# Altium project Laser-Cueing.PrjPcb
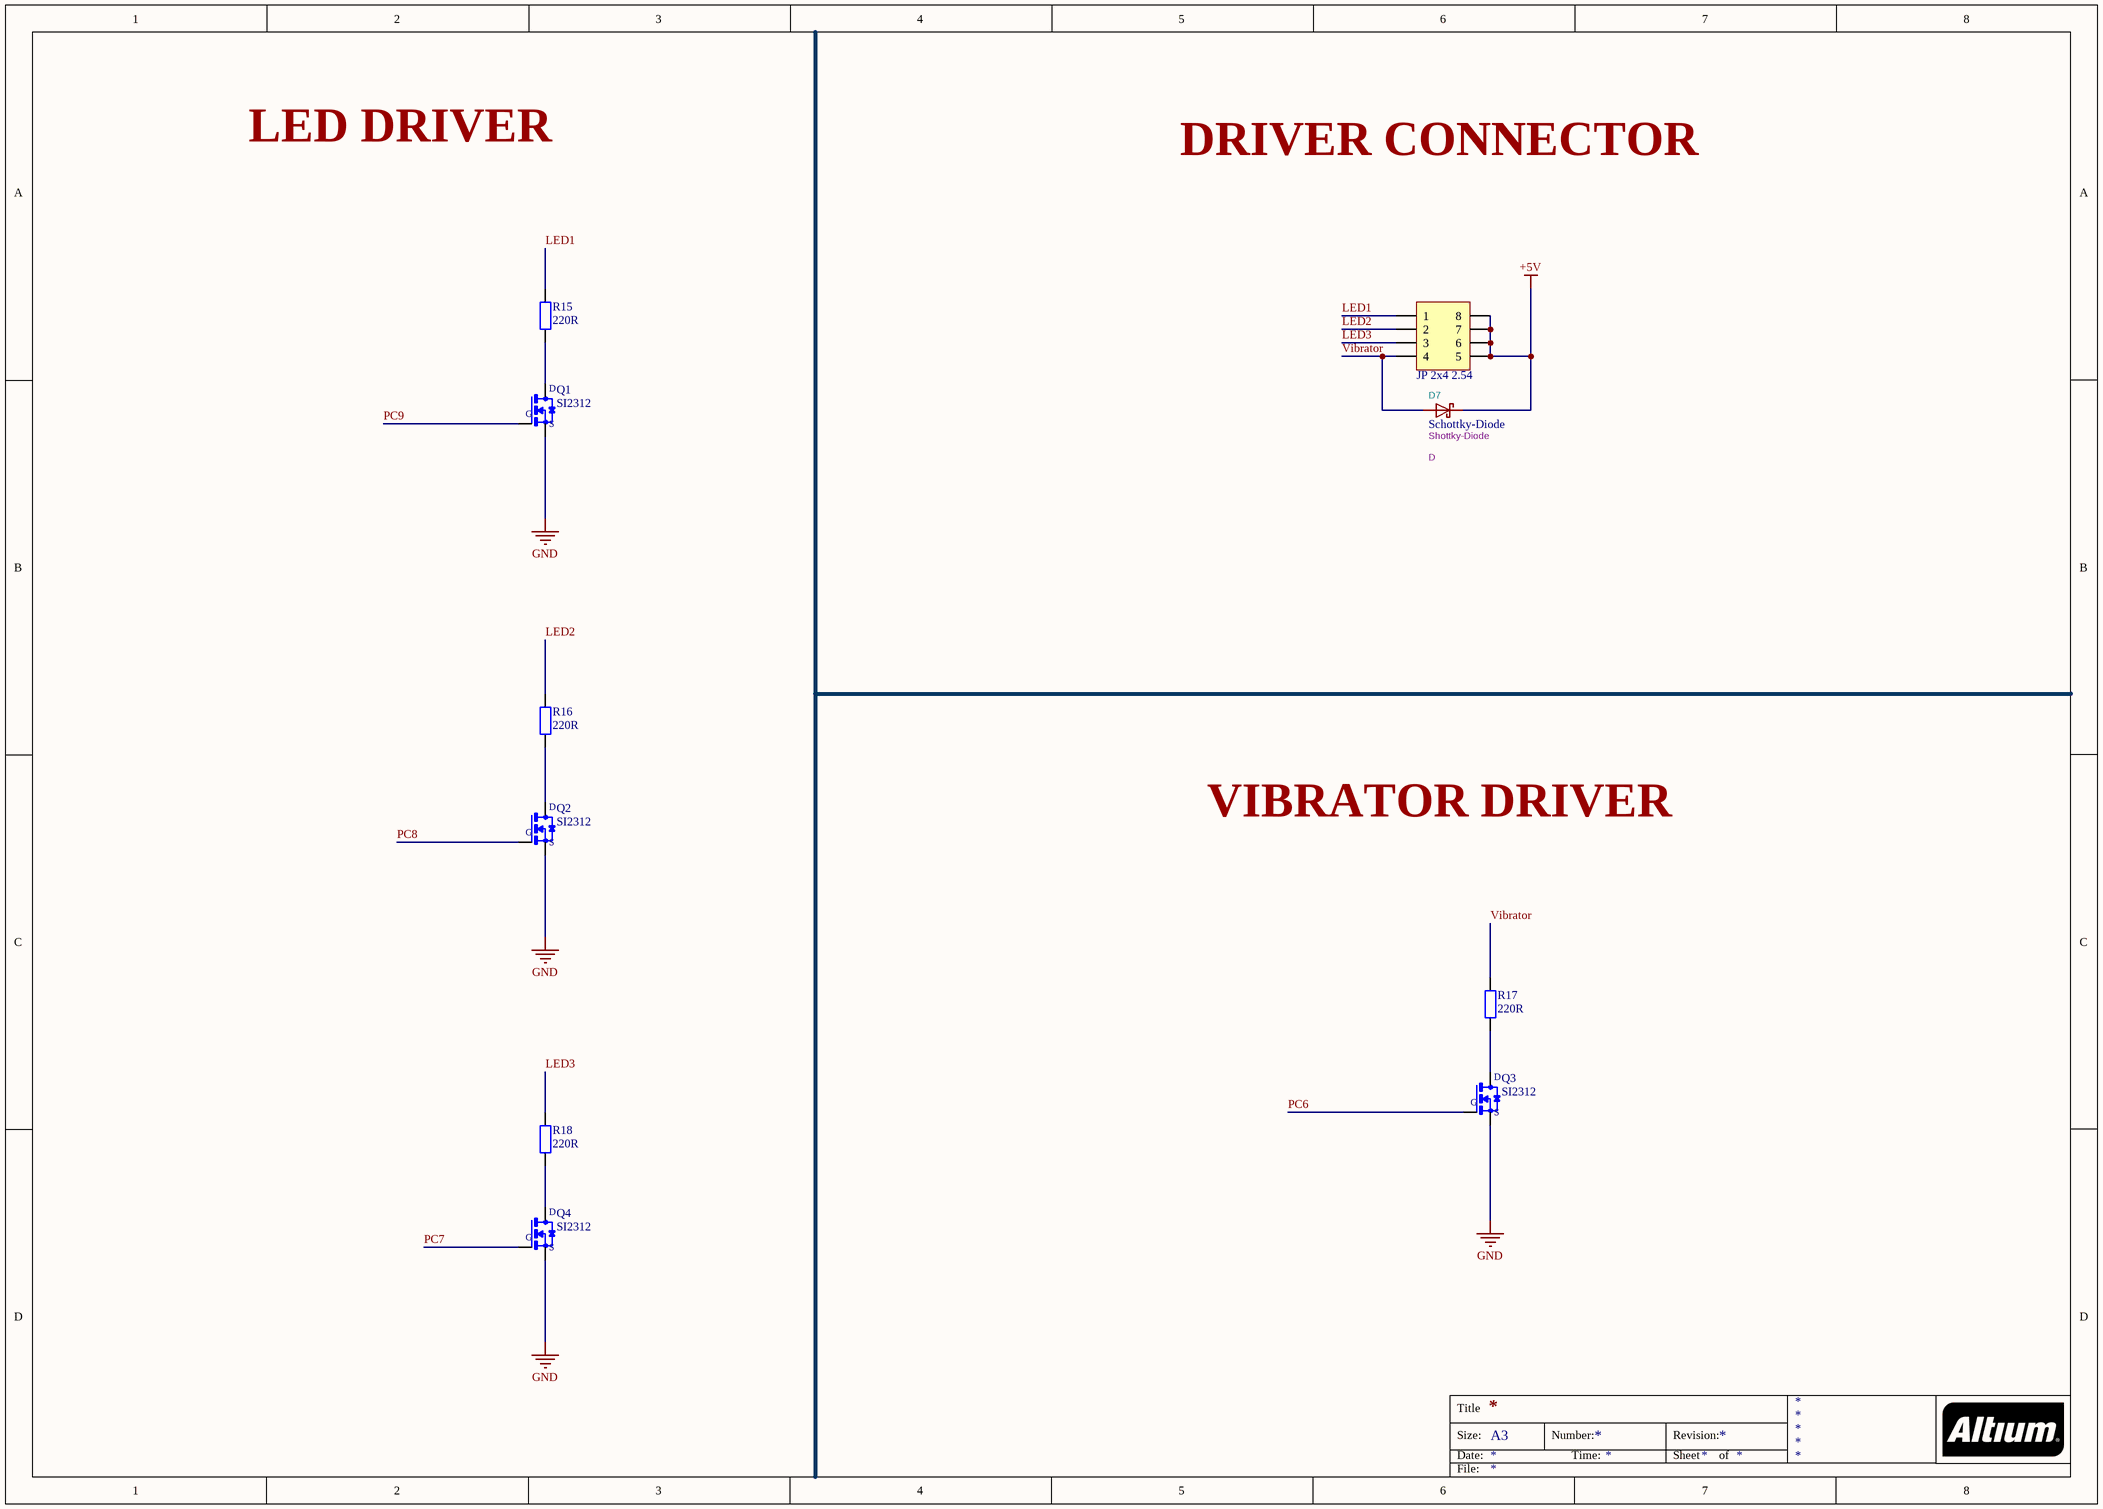
[diagram p0: Driver.SchDoc]
5 sheets, 91 parts. Net scope: global (net labels, ports and power ports of the same name join across sheets).
Board file: 06042024_LaserCueing.PcbDoc
Sheets:
  Driver.SchDoc
  STM32_MCU.SchDoc
  ADC.SchDoc
  Peripherial.SchDoc
  PWR_SRC.SchDoc

## Sheet Driver.SchDoc
size A3

### Parts
D7  Schottky-Diode  value Shottky-Diode  Reference: D  [SOD-80_MiniMELF_Glass]
Driver1  JP 2x4 2.54  [JP 2x4 DT]
Q1  SI2312  [SOT23]
Q2  SI2312  [SOT23]
Q3  SI2312  [SOT23]
Q4  SI2312  [SOT23]
R15  220R  [tro smd 0603]
R16  220R  [tro smd 0603]
R17  220R  [tro smd 0603]
R18  220R  [tro smd 0603]

### Nets
+5V: D7.K Driver1.5 Driver1.6 Driver1.7 Driver1.8
GND: Q1.2(S) Q2.2(S) Q3.2(S) Q4.2(S)
LED1: Driver1.1 R15.2
LED2: Driver1.2 R16.2
LED3: Driver1.3 R18.2
PC6: Q3.1(G)
PC7: Q4.1(G)
PC8: Q2.1(G)
PC9: Q1.1(G)
Vibrator: D7.A Driver1.4 R17.2
NetQ1_3: Q1.3(D) R15.1
NetQ2_3: Q2.3(D) R16.1
NetQ3_3: Q3.3(D) R17.1
NetQ4_3: Q4.3(D) R18.1

### Notes on the sheet
- LED DRIVER
- DRIVER CONNECTOR
- VIBRATOR DRIVER
- Title
- Size:
- Date:
- A3
- Number:
- Time:
- Revision:
- Sheet
- of
- File:

### Library data of the parts
D7 = Schottky-Diode: ki_description: Schottky Diode; Datasheet: https://diotec.com/de/produktliste/SBD.html; ki_keywords: Schottky
Driver1 = JP 2x4 2.54 Duc Thang: Cắm; Ten_Linh_Kien: Jump Đôi Đực 2.54MM 2x40P Thẳng 11MM; Don_Vi: Con; Ma_Hang: MH002686; Ghi_Chu: *; Kieu_Chan: *; Chung_Loai: Cắm
Q1-Q4 = SI2312: <b>N-Channel MOSFET</b>    <a href="https://pricing.snapeda.com/parts/SI2312/Micro%20Commercial%20Components/view-part?ref=eda">Check availability</a> <a href="https://pricing.snapeda.com/parts/SI2312/Micro%20Commercial%20Components/view-part?ref=eda">Check availability</a>; MF: {'manufacturer': u'Micro Commercial Components'}; MP: SI2312-TP; Package: None; Price: None; Value: *; Availability: Unavailable
R15-R18 = Tro 0603 5% 220R: Dán; Don_Vi: Con; So_Chan: 2; Ten_Linh_Kien: Trở 0603 5% 220R; Ma_Hang: MH006322; Chung_Loai: Dán; Kieu_Chan: *

## Sheet STM32_MCU.SchDoc
size A2
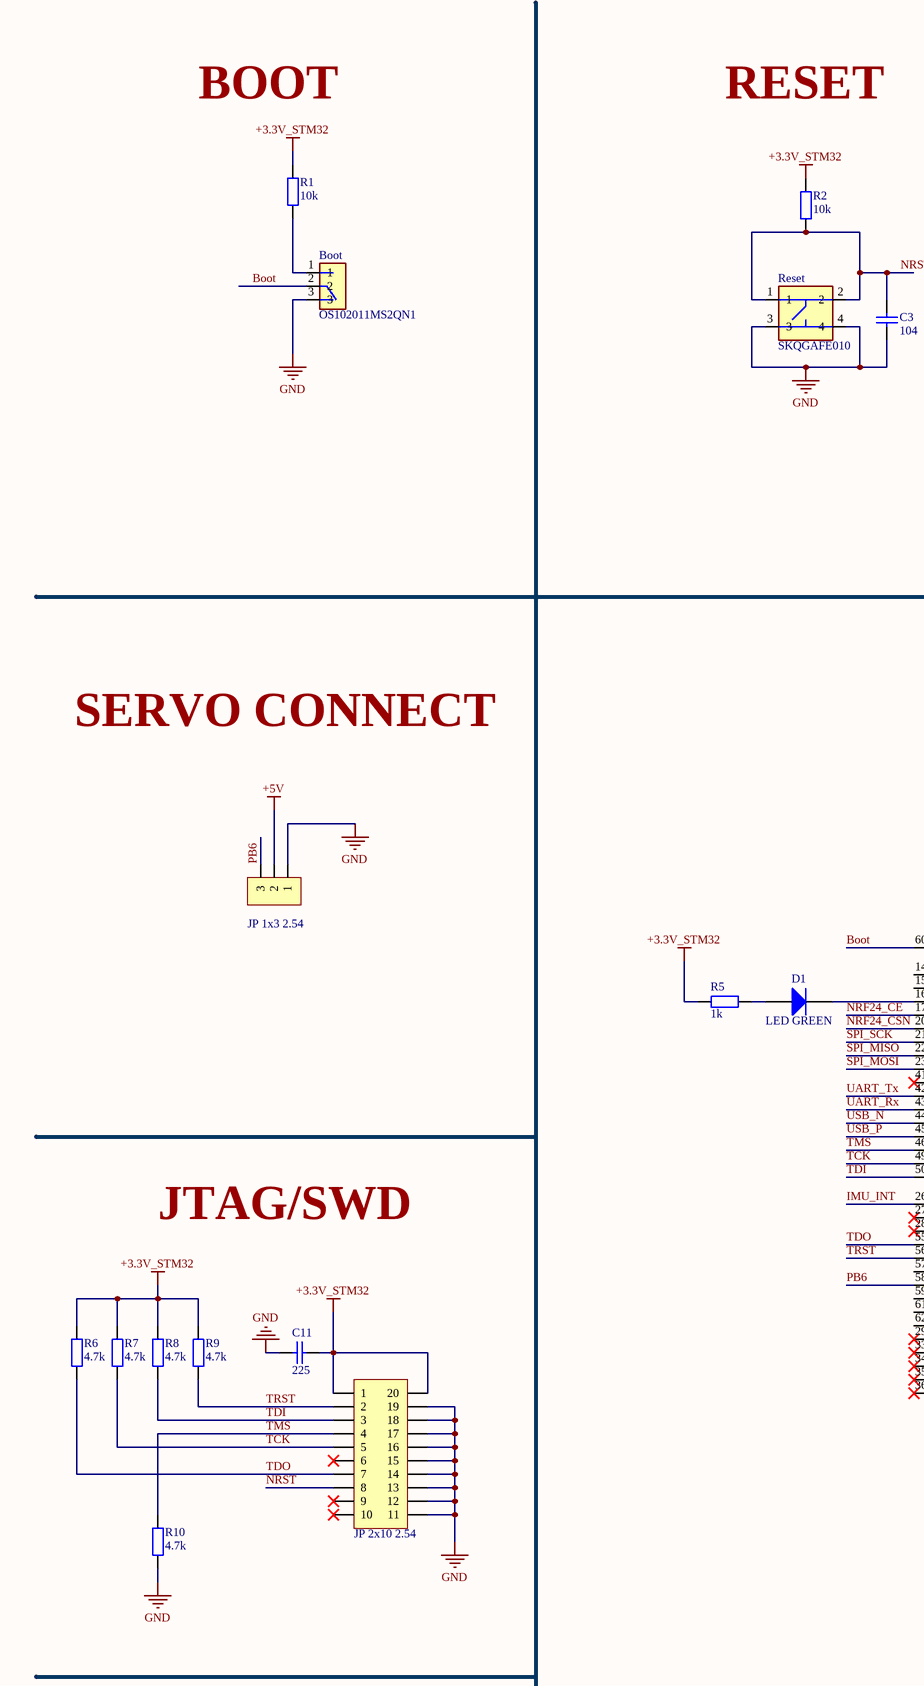
[diagram p1: STM32_MCU.SchDoc, left]
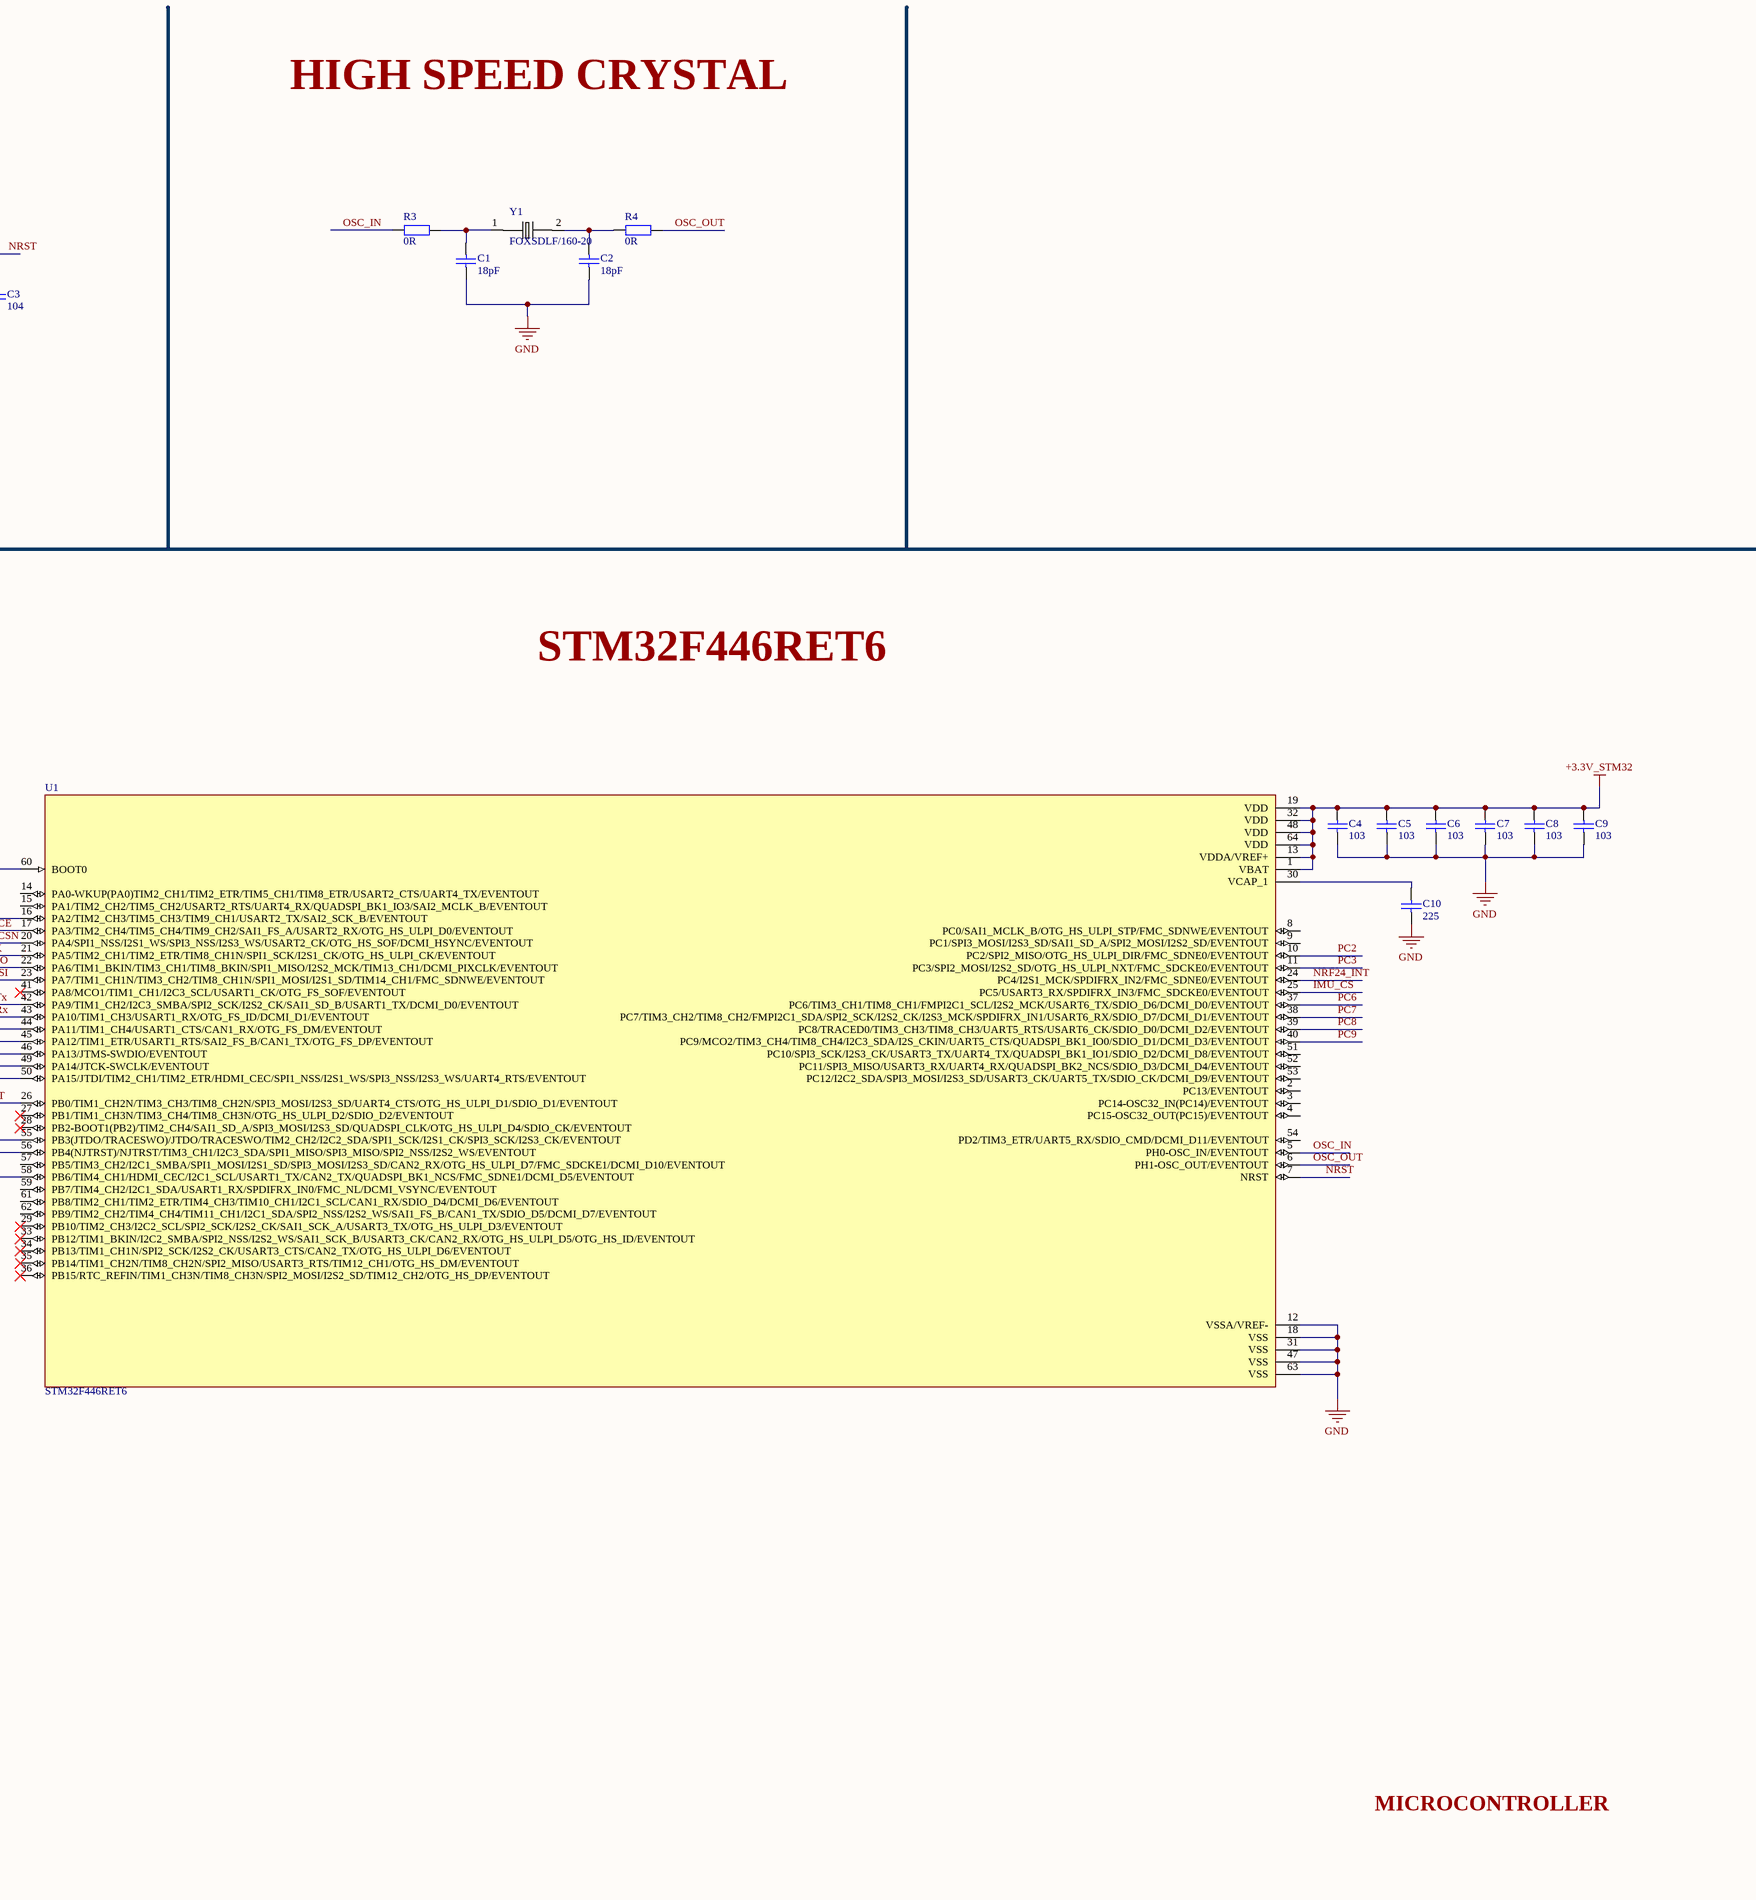
[diagram p2: STM32_MCU.SchDoc, right]

### Parts
Boot  OS102011MS2QN1  [SW_OS102011MS2QN1]
C1  18pF  [tu 0805]
C2  18pF  [tu 0805]
C3  104  [tu 1206]
C4  103  [tu 0603]
C5  103  [tu 0603]
C6  103  [tu 0603]
C7  103  [tu 0603]
C8  103  [tu 0603]
C9  103  [tu 0603]
C10  225  [tu 0805]
C11  225  [tu 0805]
D1  LED GREEN  [J1-0603]
R1  10k  [tro smd 0603]
R2  10k  [tro smd 0603]
R3  0R  [tro smd 0603]
R4  0R  [tro smd 0603]
R5  1k  [tro smd 0603]
R6  4.7k  [tro smd 0603]
R7  4.7k  [tro smd 0603]
R8  4.7k  [tro smd 0603]
R9  4.7k  [tro smd 0603]
R10  4.7k  [tro smd 0603]
Reset  SKQGAFE010  [SW_SKQGAFE010]
Servo  JP 1x3 2.54  [JP 1x3 DT]
SWD/JTAG1  JP 2x10 2.54  [JP 2x10 DT]
U1  STM32F446RET6  [QFP50P1200X1200X160-64N]
Y1  FOXSDLF/160-20  [SMD_Crystal]

### Nets
+3.3V_STM32: C4.1 C5.1 C6.1 C7.1 C8.1 C9.1 C11.1 R1.2 R2.2 R5.2 R6.2 R7.2 R8.2 R9.2 SWD/JTAG1.1 SWD/JTAG1.20 U1.1(VBAT) U1.13(VDDA/VREF+) U1.19(VDD) U1.32(VDD) U1.48(VDD) U1.64(VDD)
+5V: Servo.2
GND: Boot.3 C1.2 C2.2 C3.2 C4.2 C5.2 C6.2 C7.2 C8.2 C9.2 C10.2 C11.2 R10.1 Reset.3 Reset.4 Servo.1 SWD/JTAG1.11 SWD/JTAG1.12 SWD/JTAG1.13 SWD/JTAG1.14 SWD/JTAG1.15 SWD/JTAG1.16 SWD/JTAG1.17 SWD/JTAG1.18 SWD/JTAG1.19 U1.12(VSSA/VREF-) U1.18(VSS) U1.31(VSS) U1.47(VSS) U1.63(VSS)
Boot: Boot.2 U1.60(BOOT0)
IMU_CS: U1.25(PC5/USART3_RX/SPDIFRX_IN3/FMC_SDCKE0/EVENTOUT)
IMU_INT: U1.26(PB0/TIM1_CH2N/TIM3_CH3/TIM8_CH2N/SPI3_MOSI/I2S3_SD/UART4_CTS/OTG_HS_ULPI_D1/SDIO_D1/EVENTOUT)
NRF24_CE: U1.17(PA3/TIM2_CH4/TIM5_CH4/TIM9_CH2/SAI1_FS_A/USART2_RX/OTG_HS_ULPI_D0/EVENTOUT)
NRF24_CSN: U1.20(PA4/SPI1_NSS/I2S1_WS/SPI3_NSS/I2S3_WS/USART2_CK/OTG_HS_SOF/DCMI_HSYNC/EVENTOUT)
NRF24_INT: U1.24(PC4/I2S1_MCK/SPDIFRX_IN2/FMC_SDNE0/EVENTOUT)
NRST: C3.1 R2.1 Reset.1 Reset.2 SWD/JTAG1.8 U1.7(NRST)
OSC_IN: R3.1 U1.5(PH0-OSC_IN/EVENTOUT)
OSC_OUT: R4.2 U1.6(PH1-OSC_OUT/EVENTOUT)
PB6: Servo.3 U1.58(PB6/TIM4_CH1/HDMI_CEC/I2C1_SCL/USART1_TX/CAN2_TX/QUADSPI_BK1_NCS/FMC_SDNE1/DCMI_D5/EVENTOUT)
PC2: U1.10(PC2/SPI2_MISO/OTG_HS_ULPI_DIR/FMC_SDNE0/EVENTOUT)
PC3: U1.11(PC3/SPI2_MOSI/I2S2_SD/OTG_HS_ULPI_NXT/FMC_SDCKE0/EVENTOUT)
PC6: U1.37(PC6/TIM3_CH1/TIM8_CH1/FMPI2C1_SCL/I2S2_MCK/USART6_TX/SDIO_D6/DCMI_D0/EVENTOUT)
PC7: U1.38(PC7/TIM3_CH2/TIM8_CH2/FMPI2C1_SDA/SPI2_SCK/I2S2_CK/I2S3_MCK/SPDIFRX_IN1/USART6_RX/SDIO_D7/DCMI_D1/EVENTOUT)
PC8: U1.39(PC8/TRACED0/TIM3_CH3/TIM8_CH3/UART5_RTS/USART6_CK/SDIO_D0/DCMI_D2/EVENTOUT)
PC9: U1.40(PC9/MCO2/TIM3_CH4/TIM8_CH4/I2C3_SDA/I2S_CKIN/UART5_CTS/QUADSPI_BK1_IO0/SDIO_D1/DCMI_D3/EVENTOUT)
SPI_MISO: U1.22(PA6/TIM1_BKIN/TIM3_CH1/TIM8_BKIN/SPI1_MISO/I2S2_MCK/TIM13_CH1/DCMI_PIXCLK/EVENTOUT)
SPI_MOSI: U1.23(PA7/TIM1_CH1N/TIM3_CH2/TIM8_CH1N/SPI1_MOSI/I2S1_SD/TIM14_CH1/FMC_SDNWE/EVENTOUT)
SPI_SCK: U1.21(PA5/TIM2_CH1/TIM2_ETR/TIM8_CH1N/SPI1_SCK/I2S1_CK/OTG_HS_ULPI_CK/EVENTOUT)
TCK: R7.1 SWD/JTAG1.5 U1.49(PA14/JTCK-SWCLK/EVENTOUT)
TDI: R8.1 SWD/JTAG1.3 U1.50(PA15/JTDI/TIM2_CH1/TIM2_ETR/HDMI_CEC/SPI1_NSS/I2S1_WS/SPI3_NSS/I2S3_WS/UART4_RTS/EVENTOUT)
TDO: R6.1 SWD/JTAG1.7 U1.55(PB3(JTDO/TRACESWO)/JTDO/TRACESWO/TIM2_CH2/I2C2_SDA/SPI1_SCK/I2S1_CK/SPI3_SCK/I2S3_CK/EVENTOUT)
TMS: R10.2 SWD/JTAG1.4 U1.46(PA13/JTMS-SWDIO/EVENTOUT)
TRST: R9.1 SWD/JTAG1.2 U1.56(PB4(NJTRST)/NJTRST/TIM3_CH1/I2C3_SDA/SPI1_MISO/SPI3_MISO/SPI2_NSS/I2S2_WS/EVENTOUT)
UART_Rx: U1.43(PA10/TIM1_CH3/USART1_RX/OTG_FS_ID/DCMI_D1/EVENTOUT)
UART_Tx: U1.42(PA9/TIM1_CH2/I2C3_SMBA/SPI2_SCK/I2S2_CK/SAI1_SD_B/USART1_TX/DCMI_D0/EVENTOUT)
USB_N: U1.44(PA11/TIM1_CH4/USART1_CTS/CAN1_RX/OTG_FS_DM/EVENTOUT)
USB_P: U1.45(PA12/TIM1_ETR/USART1_RTS/SAI2_FS_B/CAN1_TX/OTG_FS_DP/EVENTOUT)
NetBoot_1: Boot.1 R1.1
NetC1_1: C1.1 R3.2 Y1.1
NetC2_1: C2.1 R4.1 Y1.2
NetC10_1: C10.1 U1.30(VCAP_1)
NetD1_1: D1.1(A) R5.1
NetD1_2: D1.2(K) U1.16(PA2/TIM2_CH3/TIM5_CH3/TIM9_CH1/USART2_TX/SAI2_SCK_B/EVENTOUT)

Not connected (* = marked no-connect by the designer): SWD/JTAG1 6* 9* 10*; U1 2(PC13/EVENTOUT) 3(PC14-OSC32_IN(PC14)/EVENTOUT) 4(PC15-OSC32_OUT(PC15)/EVENTOUT) 8(PC0/SAI1_MCLK_B/OTG_HS_ULPI_STP/FMC_SDNWE/EVENTOUT) 9(PC1/SPI3_MOSI/I2S3_SD/SAI1_SD_A/SPI2_MOSI/I2S2_SD/EVENTOUT) 14(PA0-WKUP(PA0)TIM2_CH1/TIM2_ETR/TIM5_CH1/TIM8_ETR/USART2_CTS/UART4_TX/EVENTOUT) 15(PA1/TIM2_CH2/TIM5_CH2/USART2_RTS/UART4_RX/QUADSPI_BK1_IO3/SAI2_MCLK_B/EVENTOUT) 27(PB1/TIM1_CH3N/TIM3_CH4/TIM8_CH3N/OTG_HS_ULPI_D2/SDIO_D2/EVENTOUT)* 28(PB2-BOOT1(PB2)/TIM2_CH4/SAI1_SD_A/SPI3_MOSI/I2S3_SD/QUADSPI_CLK/OTG_HS_ULPI_D4/SDIO_CK/EVENTOUT)* 29(PB10/TIM2_CH3/I2C2_SCL/SPI2_SCK/I2S2_CK/SAI1_SCK_A/USART3_TX/OTG_HS_ULPI_D3/EVENTOUT)* 33(PB12/TIM1_BKIN/I2C2_SMBA/SPI2_NSS/I2S2_WS/SAI1_SCK_B/USART3_CK/CAN2_RX/OTG_HS_ULPI_D5/OTG_HS_ID/EVENTOUT)* 34(PB13/TIM1_CH1N/SPI2_SCK/I2S2_CK/USART3_CTS/CAN2_TX/OTG_HS_ULPI_D6/EVENTOUT)* 35(PB14/TIM1_CH2N/TIM8_CH2N/SPI2_MISO/USART3_RTS/TIM12_CH1/OTG_HS_DM/EVENTOUT)* 36(PB15/RTC_REFIN/TIM1_CH3N/TIM8_CH3N/SPI2_MOSI/I2S2_SD/TIM12_CH2/OTG_HS_DP/EVENTOUT)* 41(PA8/MCO1/TIM1_CH1/I2C3_SCL/USART1_CK/OTG_FS_SOF/EVENTOUT)* 51(PC10/SPI3_SCK/I2S3_CK/USART3_TX/UART4_TX/QUADSPI_BK1_IO1/SDIO_D2/DCMI_D8/EVENTOUT) 52(PC11/SPI3_MISO/USART3_RX/UART4_RX/QUADSPI_BK2_NCS/SDIO_D3/DCMI_D4/EVENTOUT) 53(PC12/I2C2_SDA/SPI3_MOSI/I2S3_SD/USART3_CK/UART5_TX/SDIO_CK/DCMI_D9/EVENTOUT) 54(PD2/TIM3_ETR/UART5_RX/SDIO_CMD/DCMI_D11/EVENTOUT) 57(PB5/TIM3_CH2/I2C1_SMBA/SPI1_MOSI/I2S1_SD/SPI3_MOSI/I2S3_SD/CAN2_RX/OTG_HS_ULPI_D7/FMC_SDCKE1/DCMI_D10/EVENTOUT) 59(PB7/TIM4_CH2/I2C1_SDA/USART1_RX/SPDIFRX_IN0/FMC_NL/DCMI_VSYNC/EVENTOUT) 61(PB8/TIM2_CH1/TIM2_ETR/TIM4_CH3/TIM10_CH1/I2C1_SCL/CAN1_RX/SDIO_D4/DCMI_D6/EVENTOUT) 62(PB9/TIM2_CH2/TIM4_CH4/TIM11_CH1/I2C1_SDA/SPI2_NSS/I2S2_WS/SAI1_FS_B/CAN1_TX/SDIO_D5/DCMI_D7/EVENTOUT)

### Notes on the sheet
- BOOT
- RESET
- HIGH SPEED CRYSTAL
- SERVO CONNECT
- STM32F446RET6
- JTAG/SWD
- MICROCONTROLLER
- Title
- Size:
- Date:
- File:
- A2
- Number:
- Time:
- Revision:
- Sheet
- of

### Library data of the parts
Boot = OS102011MS2QN1: Switch Slide ON ON SPDT Top Slide 0.1A 12VDC 10000Cycles PC Pins Thru-Hole Bulk; MF: {'manufacturer': u'C&K'}; Package: None; Price: None; Value: *; MP: OS102011MS2QN1; Availability: Unavailable
C1 C2 = Tu 0805 20pF 50V 10%: Dán; Don_Vi: Con; Ten_Linh_Kien: Tụ 0805 20P 10% 50V; So_Chan: 2; Ma_Hang: MH004558; Chung_Loai: Dán; Kieu_Chan: *
C3 = Tu 1206 104 50V 20%: Dán; Don_Vi: Con; So_Chan: 2; Ten_Linh_Kien: Tụ 1206 104-0.1uF 20% 50V; Ma_Hang: MH004544; Chung_Loai: Dán; Kieu_Chan: *
C4-C9 = Tu 0603 103 50V 10%: Dán; Don_Vi: Con; So_Chan: 2; Ten_Linh_Kien: Tụ 0603 103-10nF 10% 50V; Ma_Hang: MH004567; Chung_Loai: Dán; Kieu_Chan: *
C10 C11 = Tu 0805 225 25V 10%: Dán; Don_Vi: Con; So_Chan: 2; Ten_Linh_Kien: Tụ 0805 225-2.2uF 25V 10%; Ma_Hang: MH007483; Chung_Loai: Dán; Kieu_Chan: *
D1 = Diode: Default Diode; Published: 8-Jun-2000; LatestRevisionDate: 17-Jul-2002; LatestRevisionNote: Re-released for DXP Platform.; PackageDocument: Sep-1996; PackageReference: SMC; Publisher: Altium Limited; Code_JEDEC: DO-214-AB
R1 R2 = Tro 0603 1% 10k: Dán; Don_Vi: Con; So_Chan: 2; Ten_Linh_Kien: Trở 0603 1% 10k; Ma_Hang: MH006333; Chung_Loai: Dán; Kieu_Chan: *
R3 R4 = Tro 0603 1% 0R: Dán; Don_Vi: Con; So_Chan: 2; Ten_Linh_Kien: Trở 0603 1% 0R; Ma_Hang: MH005792; Chung_Loai: Dán; Kieu_Chan: *
R5 = Tro 0603 1% 1k: Dán; So_Chan: 2; Don_Vi: Con; Ten_Linh_Kien: Trở 0603 1% 1k; Ma_Hang: MH006334; Chung_Loai: Dán; Kieu_Chan: *
R6-R10 = Tro 0603 5% 4.7k: Dán; Don_Vi: Con; So_Chan: 2; Ten_Linh_Kien: Trở 0603 5% 4.7k; Ma_Hang: MH006327; Chung_Loai: Dán; Kieu_Chan: *
Reset = SKQGAFE010: Switch Tactile N.O. SPST Button Gull Wing 0.05A 12VDC 0.98N SMD T/R; MF: {'manufacturer': u'ALPS'}; Package: None; Price: None; Value: *; MP: SKQGAFE010; Availability: Unavailable
Servo = JP 1x3 2.54 Duc Thang: Cắm; Ten_Linh_Kien: Jump Đơn Đực 2.54MM 1x40P Thẳng 11MM; Don_Vi: Con; Ma_Hang: MH000903; Ghi_Chu: *; Kieu_Chan: *; Chung_Loai: Cắm
SWD/JTAG1 = JP 2x10 2.54 Duc Thang: Cắm; Ten_Linh_Kien: Jump Đôi Đực 2.54MM 2x40P Thẳng 11MM; Don_Vi: Con; Ma_Hang: MH002686; Ghi_Chu: *; Kieu_Chan: *; Chung_Loai: Cắm
U1 = STM32F446RET6: MCU 32-Bit STM32 ARM Cortex M4 RISC 512KB Flash 2.5V/3.3V 64-Pin LQFP Tray; MF: {'manufacturer': u'STMicroelectronics'}; Package: None; Price: None; Value: *; MP: STM32F446RET6; Availability: Unavailable
Y1 = Crystal 16MHz 20pF 2-Pin: Crystal 16MHz 20pF 2-Pin HC-49/SD; MF: Fox; Package: HC49/US Fox; Digi-Key_Part_Number: 631-1017-2-ND; Digi-Key_Purchase_URL: https://www.digikey.tw/product-detail/en/fox-electronics/FC4SDCBMF16.0-T1/631-1017-2-ND/1024609?utm_source=snapeda&utm_medium=aggregator&utm_campaign=symbol; SnapEDA_Link: https://www.snapeda.com/parts/FOXSDLF/160-20/Fox%20Electronics/view-part/?ref=snap; MP: FOXSDLF/160-20; Value: *

## Sheet ADC.SchDoc
size A4
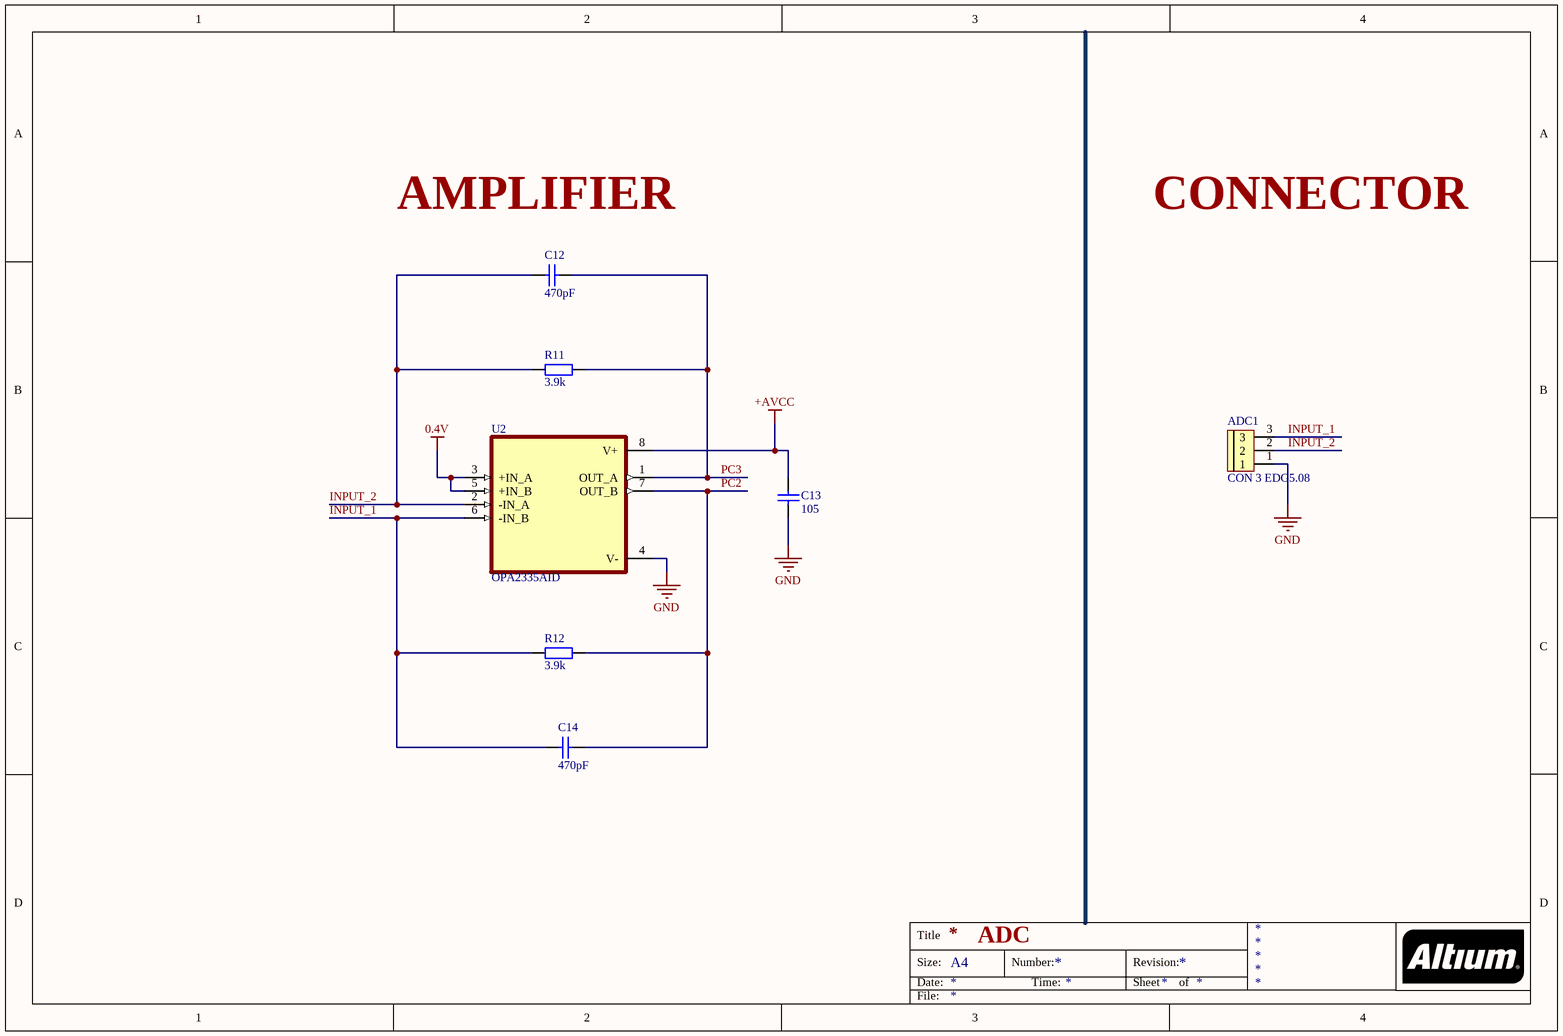
[diagram p3: ADC.SchDoc]

### Parts
ADC1  CON 3 EDG5.08  [CON 3 3EDG5.08]
C12  470pF  [tu 0603]
C13  105  [tu 1206]
C14  470pF  [tu 0603]
R11  3.9k  [tro smd 0603]
R12  3.9k  [tro smd 0603]
U2  OPA2335AID  [SOIC127P599X175-8N]

### Nets
0.4V: U2.3(+IN_A) U2.5(+IN_B)
+AVCC: C13.1 U2.8(V+)
GND: ADC1.1 C13.2 U2.4(V-)
INPUT_1: ADC1.3 C14.2 R12.1 U2.6(-IN_B)
INPUT_2: ADC1.2 C12.2 R11.1 U2.2(-IN_A)
PC2: C14.1 R12.2 U2.7(OUT_B)
PC3: C12.1 R11.2 U2.1(OUT_A)

### Notes on the sheet
- AMPLIFIER
- CONNECTOR
- ADC
- Title
- Size:
- Date:
- A4
- Number:
- Time:
- Revision:
- Sheet
- of
- File:

### Library data of the parts
ADC1 = CON 3 EDG5.08: Cắm; Ten_Linh_Kien: CON 3 2EDG5.08-3P 5.08MM ( Xanh Cong); Ma_Hang: MH000760; Ghi_Chu: *; Kieu_Chan: *; Don_Vi: Con; Chung_Loai: Cắm
C12 C14 = Tu 0603 470pF 50V 10%: Dán; Don_Vi: Con; So_Chan: 2; Ten_Linh_Kien: Tụ 0603 470P 50V 10%; Ma_Hang: MH004571; Chung_Loai: Dán; Kieu_Chan: *
C13 = Tu 1206 105 50V 20%: Dán; Don_Vi: Con; So_Chan: 2; Ten_Linh_Kien: Tụ 1206 105-1uF 20% 50V; Ma_Hang: MH004545; Chung_Loai: Dán; Kieu_Chan: *
R11 R12 = Tro 0603 1% 3.9k: Dán; So_Chan: 2; Ten_Linh_Kien: Trở 0603 1% 3.9k; Ma_Hang: MH005793; Don_Vi: Con; Chung_Loai: Dán; Kieu_Chan: *
U2 = OPA2335AID: MF: {'manufacturer': u'Texas Instruments'}; Package: None; Price: None; Value: *; MP: OPA2335AID; Availability: Unavailable

## Sheet Peripherial.SchDoc
size A3
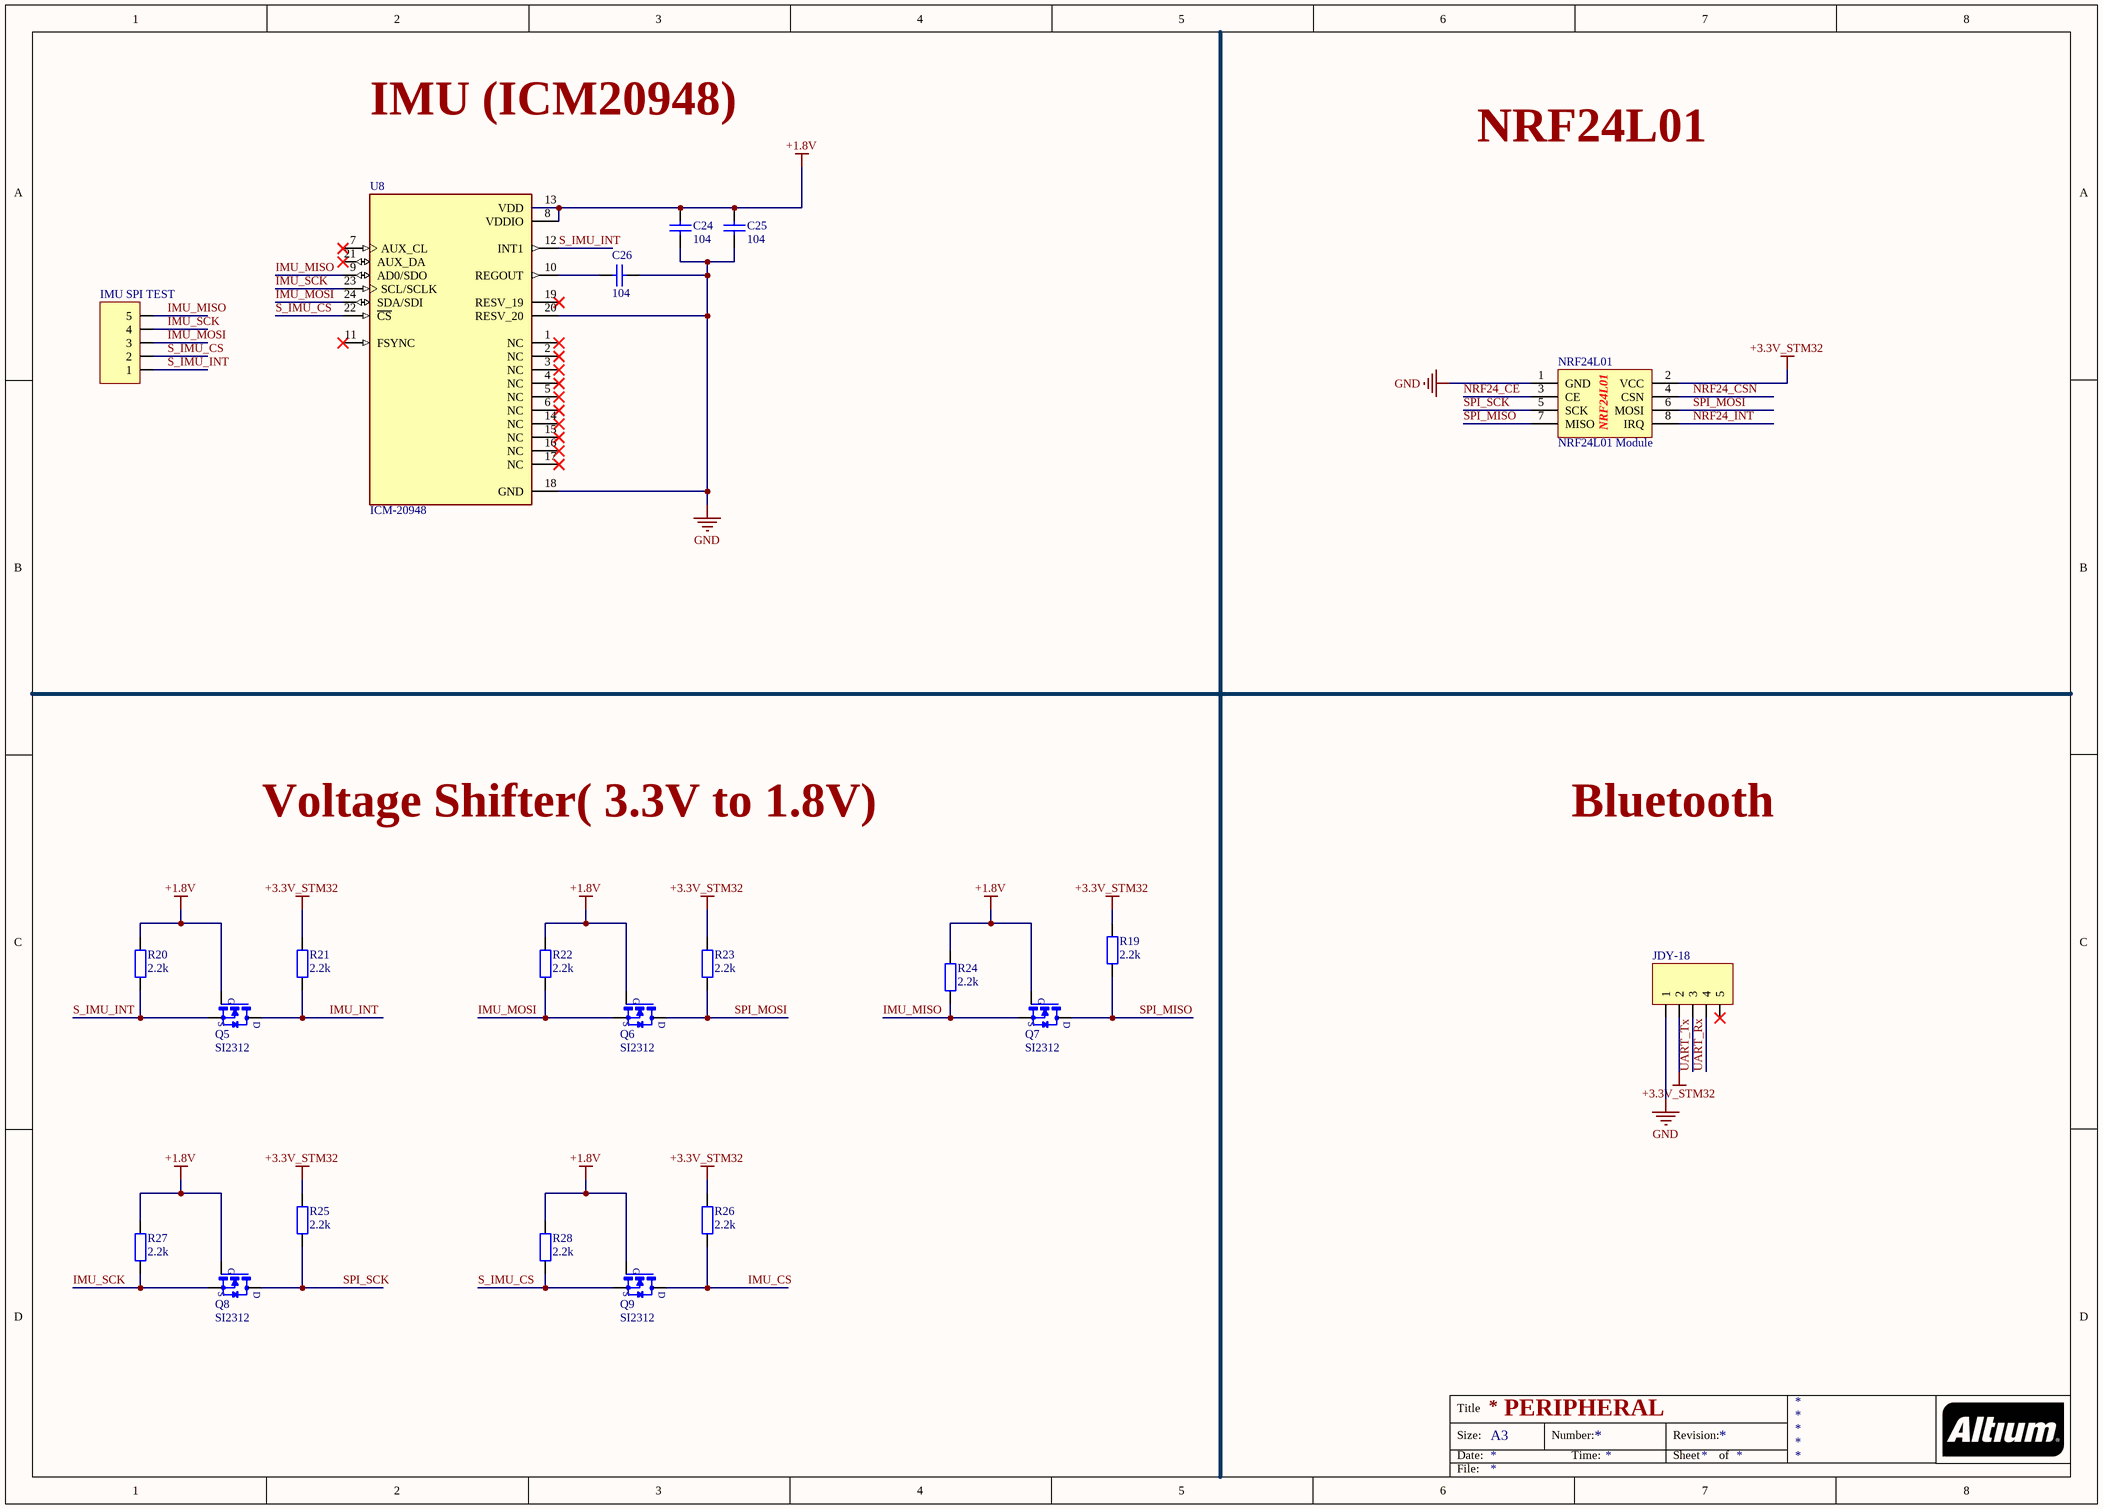
[diagram p4: Peripherial.SchDoc]

### Parts
C24  104  [tu 1206]
C25  104  [tu 1206]
C26  104  [tu 1206]
IMU_SPI_TEST  (no value)  [JP 1x5 DT]
JDY-18  JP 1x5 2.54  [JP 1x5 CC]  (value not drawn)
NRF24L01  NRF24L01 Module  [NRF24L01]
Q5  SI2312  [SOT23]
Q6  SI2312  [SOT23]
Q7  SI2312  [SOT23]
Q8  SI2312  [SOT23]
Q9  SI2312  [SOT23]
R19  2.2k  [tro smd 0603]
R20  2.2k  [tro smd 0603]
R21  2.2k  [tro smd 0603]
R22  2.2k  [tro smd 0603]
R23  2.2k  [tro smd 0603]
R24  2.2k  [tro smd 0603]
R25  2.2k  [tro smd 0603]
R26  2.2k  [tro smd 0603]
R27  2.2k  [tro smd 0603]
R28  2.2k  [tro smd 0603]
U8  ICM-20948  [QFN40P300X300X105-24N]

### Nets
+1.8V: C24.1 C25.1 Q5.1(G) Q6.1(G) Q7.1(G) Q8.1(G) Q9.1(G) R20.2 R22.2 R24.2 R27.2 R28.2 U8.8(VDDIO) U8.13(VDD)
+3.3V_STM32: JDY-18.2 NRF24L01.2(VCC) R19.2 R21.2 R23.2 R25.2 R26.2
GND: C24.2 C25.2 C26.2 JDY-18.1 NRF24L01.1(GND) U8.18(GND) U8.20(RESV_20)
IMU_CS: Q9.3(D) R26.1
IMU_INT: Q5.3(D) R21.1
IMU_MISO: IMU_SPI_TEST.5 Q7.2(S) R24.1 U8.9(AD0/SDO)
IMU_MOSI: IMU_SPI_TEST.3 Q6.2(S) R22.1 U8.24(SDA/SDI)
IMU_SCK: IMU_SPI_TEST.4 Q8.2(S) R27.1 U8.23(SCL/SCLK)
NRF24_CE: NRF24L01.3(CE)
NRF24_CSN: NRF24L01.4(CSN)
NRF24_INT: NRF24L01.8(IRQ)
S_IMU_CS: IMU_SPI_TEST.2 Q9.2(S) R28.1 U8.22(~{CS})
S_IMU_INT: IMU_SPI_TEST.1 Q5.2(S) R20.1 U8.12(INT1)
SPI_MISO: NRF24L01.7(MISO) Q7.3(D) R19.1
SPI_MOSI: NRF24L01.6(MOSI) Q6.3(D) R23.1
SPI_SCK: NRF24L01.5(SCK) Q8.3(D) R25.1
UART_Rx: JDY-18.4
UART_Tx: JDY-18.3
NetC26_1: C26.1 U8.10(REGOUT)

Not connected (* = marked no-connect by the designer): JDY-18 5*; U8 1(NC)* 2(NC)* 3(NC)* 4(NC)* 5(NC)* 6(NC)* 7(AUX_CL)* 11(FSYNC)* 14(NC)* 15(NC)* 16(NC)* 17(NC)* 19(RESV_19)* 21(AUX_DA)*

### Notes on the sheet
- IMU (ICM20948)
- NRF24L01
- Voltage Shifter( 3.3V to 1.8V)
- Bluetooth
- PERIPHERAL
- Title
- Size:
- Date:
- A3
- Number:
- Time:
- Revision:
- Sheet
- of
- File:

### Library data of the parts
C24-C26 = Tu 1206 104 50V 20%: as C3 on sheet STM32_MCU; Chung_Loai: Dán; Kieu_Chan: *
IMU_SPI_TEST = JP 1x5 2.54 Duc Thang: Cắm; Ten_Linh_Kien: Jump Đơn Đực 2.54MM 1x40P Thẳng 11MM; Don_Vi: Con; Ma_Hang: MH000903; Ghi_Chu: *; Kieu_Chan: *; Chung_Loai: Cắm
JDY-18 = JP 1x5 2.54 Cai Cong: Cắm; Ten_Linh_Kien: Jump Đơn Cái 2.54MM 1x40P Cong; Don_Vi: Con; Ma_Hang: MH001265; Ghi_Chu: *; Kieu_Chan: *; Chung_Loai: Cắm
Q5-Q9 = SI2312: as Q1 on sheet Driver; Package: None; Price: None; Value: *; Availability: Unavailable
R19-R28 = Tro 0603 5% 2.2k: Dán; Don_Vi: Con; So_Chan: 2; Ten_Linh_Kien: Trở 0603 5% 2.2k; Ma_Hang: MH006321; Chung_Loai: Dán; Kieu_Chan: *
U8 = ICM-20948: Accelerometer, Gyroscope, Magnetometer, 9 Axis Sensor IÂ²C, SPI Output; MF: {'manufacturer': u'TDK InvenSense'}; Package: None; Price: None; Value: *; MP: ICM-20948; Availability: Unavailable

## Sheet PWR_SRC.SchDoc
size A3
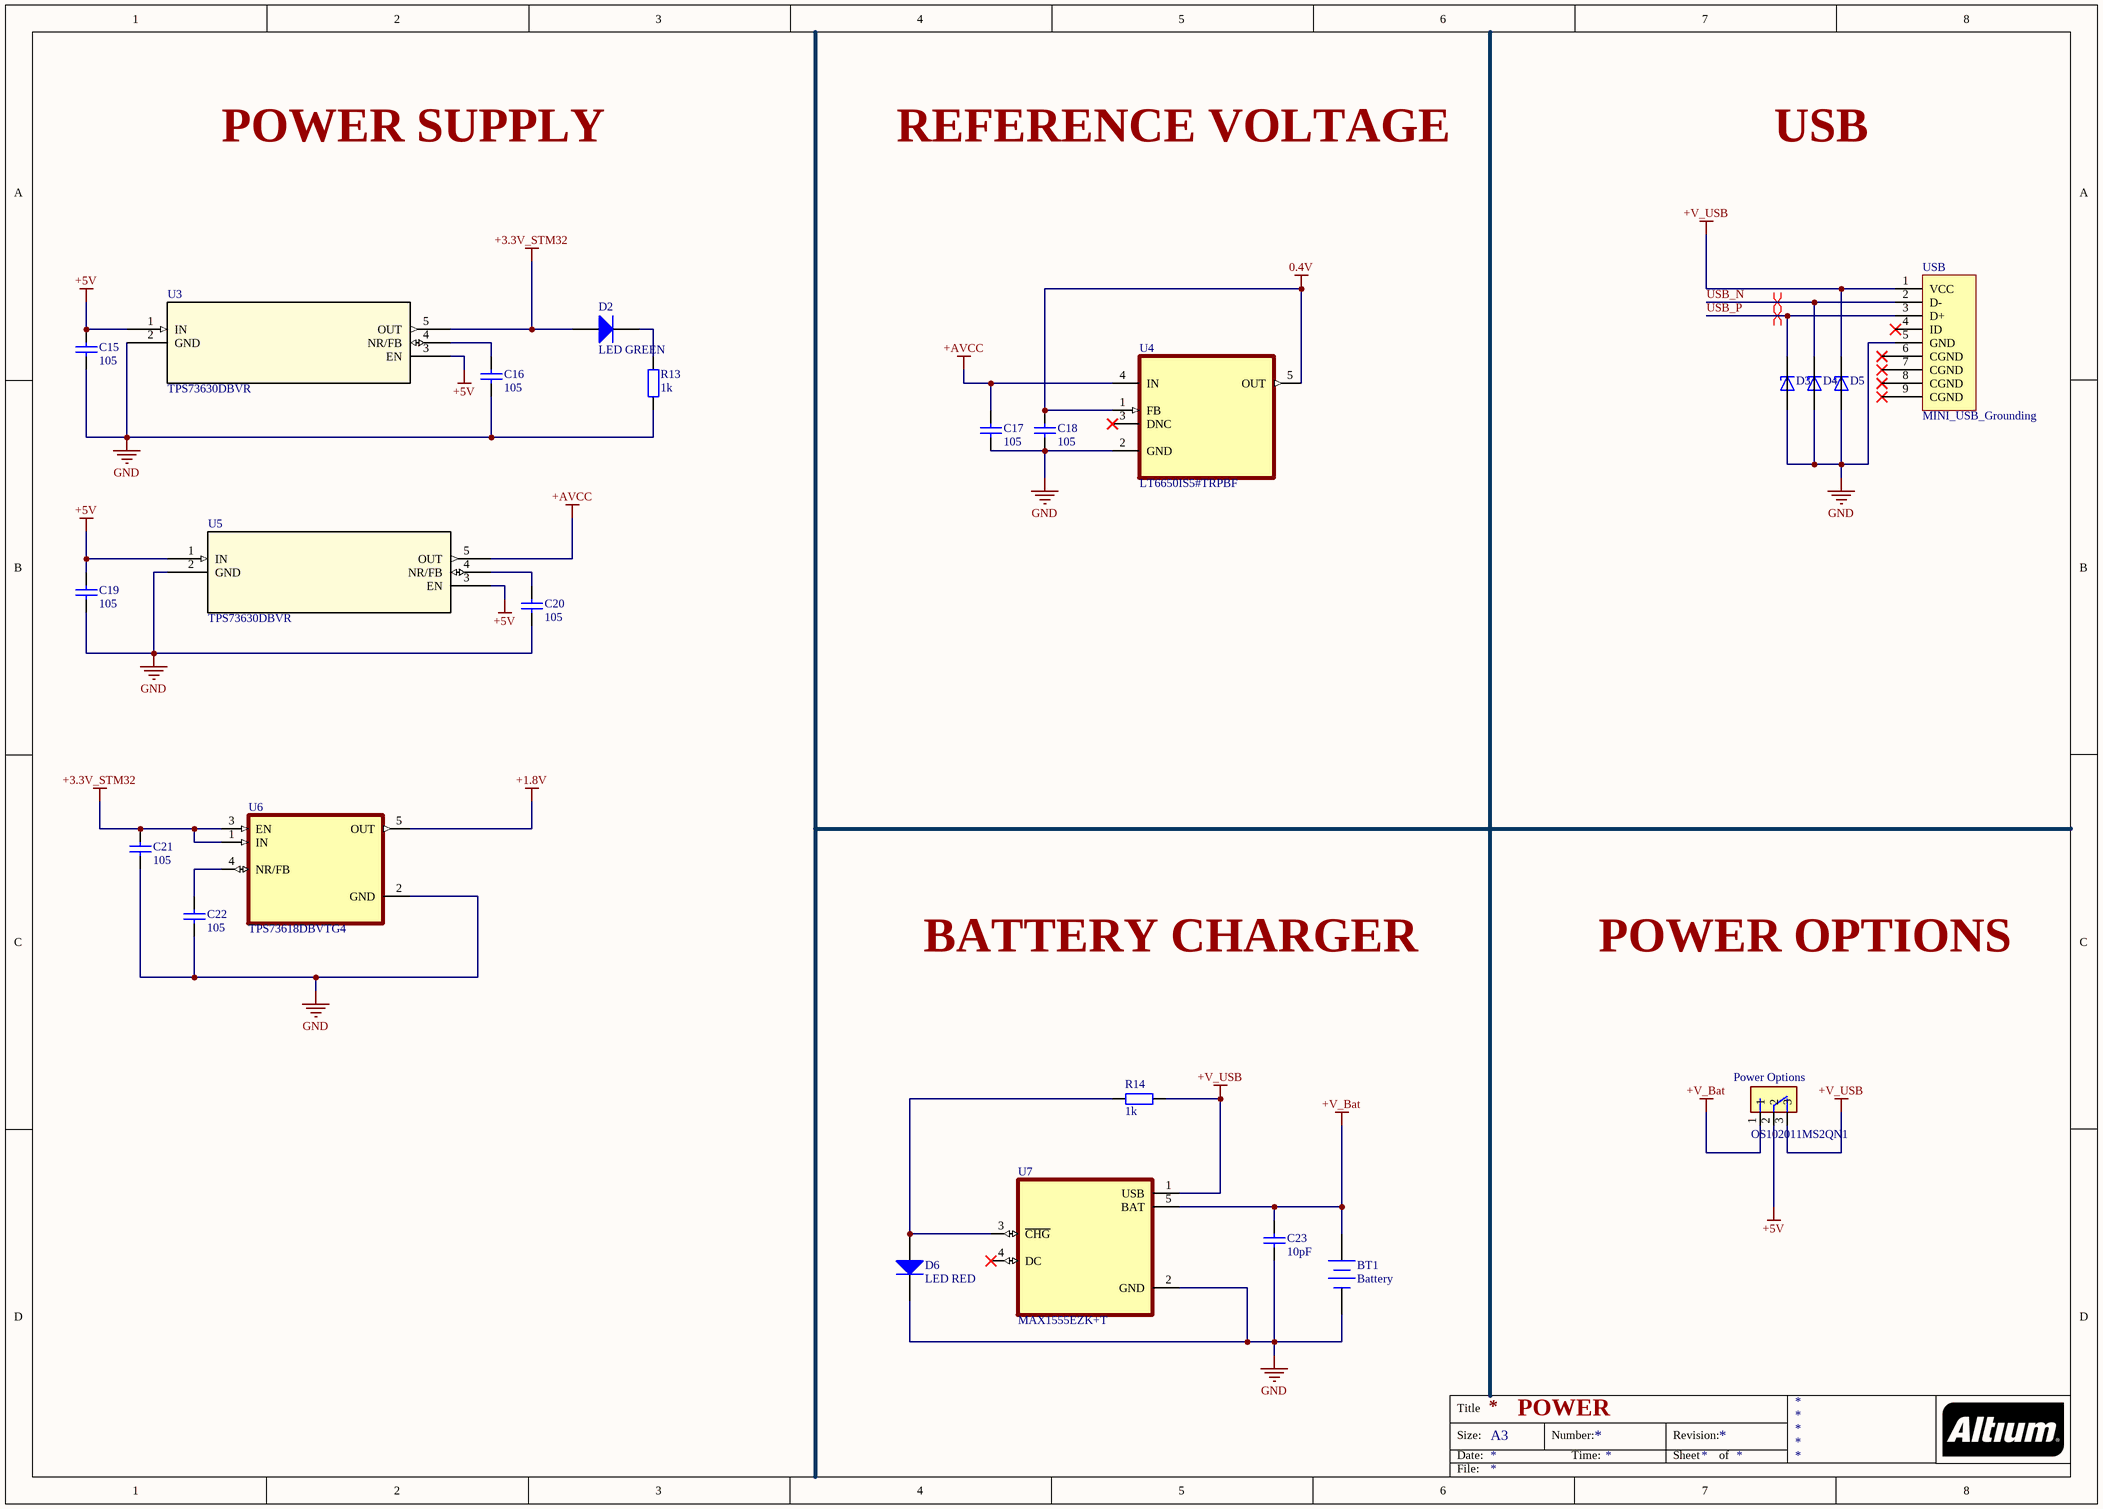
[diagram p5: PWR_SRC.SchDoc]

### Parts
BT1  Battery  [BAT-2]
C15  105  [tu 0603]
C16  105  [tu 0603]
C17  105  [tu 0603]
C18  105  [tu 0603]
C19  105  [tu 0603]
C20  105  [tu 0603]
C21  105  [tu 0603]
C22  105  [tu 0603]
C23  10pF  [tu 0805]
D2  LED GREEN  [J1-0603]
D3  AVRL161A1R1NTA  [TVS_AVRL161A1R1NTA]  (value not drawn)
D4  AVRL161A1R1NTA  [TVS_AVRL161A1R1NTA]  (value not drawn)
D5  AVRL161A1R1NTA  [TVS_AVRL161A1R1NTA]  (value not drawn)
D6  LED RED  [J1-0603]
Power_Options  OS102011MS2QN1  [SW_OS102011MS2QN1]
R13  1k  [tro smd 0603]
R14  1k  [tro smd 0603]
U3  TPS73630DBVR  [DBV5-M]
U4  LT6650IS5#TRPBF  [SOT95P280X100-5N]
U5  TPS73630DBVR  [DBV5-M]
U6  TPS73618DBVTG4  [SOT95P280X145-5N]
U7  MAX1555EZK+T  [SOT95P275X110-5N]
USB  MINI_USB_Grounding  [micro_USB shilding]

### Nets
0.4V: C18.1 U4.1(FB) U4.5(OUT)
+1.8V: U6.5(OUT)
+3.3V_STM32: C21.1 D2.1(A) U3.5(OUT) U6.1(IN) U6.3(EN)
+5V: C15.1 C19.1 Power_Options.2 U3.1(IN) U3.3(EN) U5.1(IN) U5.3(EN)
+AVCC: C17.1 U4.4(IN) U5.5(OUT)
+V_Bat: BT1.1(+) C23.1 Power_Options.1 U7.5(BAT)
+V_USB: D5.1(C) Power_Options.3 R14.2 U7.1(USB) USB.1(VCC)
GND: BT1.2(-) C15.2 C16.2 C17.2 C18.2 C19.2 C20.2 C21.2 C22.2 C23.2 D3.2(A) D4.2(A) D5.2(A) D6.2(K) R13.2 U3.2(GND) U4.2(GND) U5.2(GND) U6.2(GND) U7.2(GND) USB.5(GND)
USB_N: D4.1(C) USB.2(D-)
USB_P: D3.1(C) USB.3(D+)
NetC16_1: C16.1 U3.4(NR/FB)
NetC20_1: C20.1 U5.4(NR/FB)
NetC22_1: C22.1 U6.4(NR/FB)
NetD2_2: D2.2(K) R13.1
NetD6_1: D6.1(A) R14.1 U7.3(~{CHG})

Not connected (* = marked no-connect by the designer): U4 3(DNC)*; U7 4(DC)*; USB 4(ID)* 6(CGND)* 7(CGND)* 8(CGND)* 9(CGND)*

### Layout directives
differential pair; differential pair class diff90: USB_N, USB_P

### Notes on the sheet
- POWER SUPPLY
- REFERENCE VOLTAGE
- USB
- BATTERY CHARGER
- POWER OPTIONS
- POWER
- Title
- Size:
- Date:
- A3
- Number:
- Time:
- Revision:
- Sheet
- of
- File:

### Library data of the parts
BT1 = Battery: Multicell Battery; Published: 24-Mar-1999; LatestRevisionDate: 17-Jul-2002; LatestRevisionNote: Re-released for DXP Platform.; PackageReference: BAT-2; Publisher: Altium Limited; PackageDescription: Battery; 2 Leads
C15-C22 = Tu 0603 105 16V 20%: Dán; Don_Vi: Con; So_Chan: 2; Ten_Linh_Kien: Tụ 0603 105-1uF 20% 16V; Ma_Hang: MH004574; Chung_Loai: Dán; Kieu_Chan: *
C23 = Tu 0805 10pF 50V 10%: Dán; Don_Vi: Con; So_Chan: 2; Ten_Linh_Kien: Tụ 0805 10P 10% 50V; Ma_Hang: MH004554; Chung_Loai: Dán; Kieu_Chan: *
D2 D6 = Diode: Default Diode; Published: 8-Jun-2000; LatestRevisionDate: 17-Jul-2002; LatestRevisionNote: Re-released for DXP Platform.; PackageDocument: Sep-1996; PackageReference: SMC; Publisher: Altium Limited; Code_JEDEC: DO-214-AB
D3-D5 = AVRL161A1R1NTA: MF: {'manufacturer': u'TDK'}; Package: None; Price: None; Value: *; MP: AVRL161A1R1NTA; Availability: Unavailable
Power_Options = OS102011MS2QN1: as Boot on sheet STM32_MCU; Package: None; Price: None; Value: *; MP: OS102011MS2QN1; Availability: Unavailable
R13 = Tro 0603 5% 1k: Dán; Don_Vi: Con; So_Chan: 2; Ten_Linh_Kien: Trở 0603 5% 1k; Ma_Hang: MH006319; Chung_Loai: Dán; Kieu_Chan: *
R14 = Tro 0603 1% 1k: as R5 on sheet STM32_MCU; Chung_Loai: Dán; Kieu_Chan: *
U3 U5 = TPS73630DBVR: No Description Available; Mfr_Name: Texas Instruments; RefDes: RefDes; Type: Type
U4 = LT6650IS5#TRPBF: Micropower, 400mV Reference with Rail-to-Rail Buffer Amplifier; MF: {'manufacturer': u'Analog Devices'}; Package: None; Price: None; Value: *; MP: LT6650IS5#TRPBF; Availability: Unavailable
U6 = TPS73618DBVTG4: MF: {'manufacturer': u'Texas Instruments'}; Package: None; Price: None; Value: *; MP: TPS73618DBVTG4; Availability: Unavailable
U7 = MAX1555EZK+T: MF: {'manufacturer': u'Analog Devices'}; Package: None; Price: None; Value: *; MP: MAX1555EZK+; Availability: Unavailable

## Nets that join several sheets
0.4V: ADC (U2.3 U2.5), PWR_SRC (C18.1 U4.1 U4.5)
+1.8V: Peripherial (14 pins), PWR_SRC (U6.5)
+3.3V_STM32: STM32_MCU (22 pins), Peripherial (7 pins), PWR_SRC (5 pins)
+5V: Driver (5 pins), STM32_MCU (Servo.2), PWR_SRC (7 pins)
+AVCC: ADC (C13.1 U2.8), PWR_SRC (C17.1 U4.4 U5.5)
GND: Driver (Q1.2 Q2.2 Q3.2 Q4.2), STM32_MCU (30 pins), ADC (ADC1.1 C13.2 U2.4), Peripherial (7 pins), PWR_SRC (21 pins)
IMU_CS: STM32_MCU (U1.25), Peripherial (Q9.3 R26.1)
IMU_INT: STM32_MCU (U1.26), Peripherial (Q5.3 R21.1)
NRF24_CE: STM32_MCU (U1.17), Peripherial (NRF24L01.3)
NRF24_CSN: STM32_MCU (U1.20), Peripherial (NRF24L01.4)
NRF24_INT: STM32_MCU (U1.24), Peripherial (NRF24L01.8)
PC2: STM32_MCU (U1.10), ADC (C14.1 R12.2 U2.7)
PC3: STM32_MCU (U1.11), ADC (C12.1 R11.2 U2.1)
PC6: Driver (Q3.1), STM32_MCU (U1.37)
PC7: Driver (Q4.1), STM32_MCU (U1.38)
PC8: Driver (Q2.1), STM32_MCU (U1.39)
PC9: Driver (Q1.1), STM32_MCU (U1.40)
SPI_MISO: STM32_MCU (U1.22), Peripherial (NRF24L01.7 Q7.3 R19.1)
SPI_MOSI: STM32_MCU (U1.23), Peripherial (NRF24L01.6 Q6.3 R23.1)
SPI_SCK: STM32_MCU (U1.21), Peripherial (NRF24L01.5 Q8.3 R25.1)
UART_Rx: STM32_MCU (U1.43), Peripherial (JDY-18.4)
UART_Tx: STM32_MCU (U1.42), Peripherial (JDY-18.3)
USB_N: STM32_MCU (U1.44), PWR_SRC (D4.1 USB.2)
USB_P: STM32_MCU (U1.45), PWR_SRC (D3.1 USB.3)